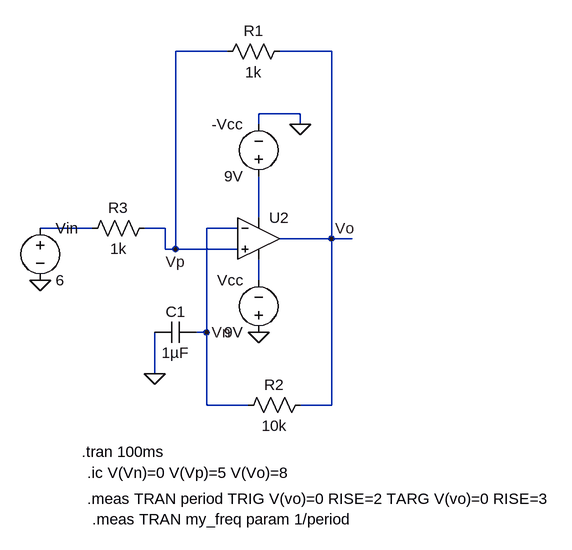
[diagram p0: schematic Amplifier.asc]
Amplifier.asc, the LTspice schematic file:
Version 4.1
SHEET 1 880 680
WIRE 224 -128 144 -128
WIRE 384 -128 304 -128
WIRE 336 -32 272 -32
WIRE 272 -16 272 -32
WIRE 336 -16 336 -32
WIRE 272 128 272 64
WIRE 16 144 -64 144
WIRE 128 144 96 144
WIRE 240 144 192 144
WIRE 384 160 384 -128
WIRE 384 160 304 160
WIRE 416 160 384 160
WIRE 128 176 128 144
WIRE 144 176 144 -128
WIRE 144 176 128 176
WIRE 240 176 144 176
WIRE 272 224 272 192
WIRE 192 304 192 144
WIRE 192 304 176 304
WIRE 112 368 112 304
WIRE 192 416 192 304
WIRE 256 416 192 416
WIRE 384 416 384 160
WIRE 384 416 336 416
FLAG 336 -16 0
FLAG 272 304 0
FLAG 112 368 0
FLAG -64 224 0
FLAG 384 160 Vo
FLAG 192 304 Vn
FLAG 144 176 Vp
SYMBOL voltage -64 128 R0
SYMATTR InstName Vin
SYMATTR Value 6
SYMBOL cap 176 288 R90
WINDOW 0 0 32 VBottom 2
WINDOW 3 32 32 VTop 2
SYMATTR InstName C1
SYMATTR Value 1µF
SYMBOL res 320 -144 R90
WINDOW 0 0 56 VBottom 2
WINDOW 3 32 56 VTop 2
SYMATTR InstName R1
SYMATTR Value 1k
SYMBOL voltage 272 80 R180
WINDOW 0 24 96 Left 2
WINDOW 3 24 16 Left 2
SYMATTR InstName -Vcc
SYMATTR Value 9V
SYMBOL voltage 272 320 R180
WINDOW 0 24 96 Left 2
WINDOW 3 24 16 Left 2
SYMATTR InstName Vcc
SYMATTR Value 9V
SYMBOL res 352 400 R90
WINDOW 0 0 56 VBottom 2
WINDOW 3 32 56 VTop 2
SYMATTR InstName R2
SYMATTR Value 10k
SYMBOL res 112 128 R90
WINDOW 0 0 56 VBottom 2
WINDOW 3 32 56 VTop 2
SYMATTR InstName R3
SYMATTR Value 1k
SYMBOL OpAmps\\UniversalOpAmp2 272 160 R0
SYMATTR InstName U2
TEXT 0 488 Left 2 !.tran 100ms
TEXT 8 520 Left 2 !.ic V(Vn)=0 V(Vp)=5 V(Vo)=8
TEXT 8 560 Left 2 !.meas TRAN period TRIG V(vo)=0 RISE=2 TARG V(vo)=0 RISE=3
TEXT 16 592 Left 2 !.meas TRAN my_freq param 1/period

The netlist it stands for:
* Amplifier.asc
Vin N002 0 6
C1 Vn 0 1µF
R1 Vo Vp 1k
V§-Vcc N001 0 9V
Vcc 0 N003 9V
R2 Vo Vn 10k
R3 Vp N002 1k
X§U2 Vp Vn N001 N003 Vo level2 Avol=1Meg GBW=10Meg Slew=10Meg Ilimit=25m Rail=0 Vos=0 En=0 Enk=0 In=0 Ink=0 Rin=500Meg  ; pins In+ In- V+ V- OUT
.tran 100ms
.ic V(Vn)=0 V(Vp)=5 V(Vo)=8
.meas TRAN period TRIG V(vo)=0 RISE=2 TARG V(vo)=0 RISE=3
.meas TRAN my_freq param 1/period
.lib UniversalOpAmp2.lib
.backanno
.end